# Altium schematic sheet LoRa.SchDoc
size A4
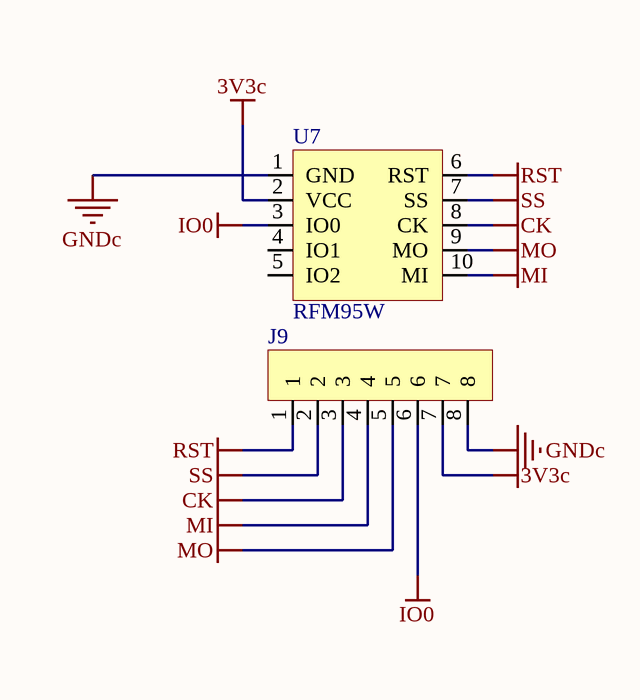
[diagram p0: LoRa.SchDoc]

## Parts
J9  8x1 CONN  [CONN8x1_2.54]  (value not drawn)
U7  RFM95W  [Bluee LoRa]

## Nets
3V3c: J9.7 U7.2(VCC)
CK: J9.3 U7.8(CK)
GNDc: J9.8 U7.1(GND)
IO0: J9.6 U7.3(IO0)
MI: J9.4 U7.10(MI)
MO: J9.5 U7.9(MO)
RST: J9.1 U7.6(RST)
SS: J9.2 U7.7(SS)

Not connected (* = marked no-connect by the designer): U7 4(IO1) 5(IO2)

## Library data of the parts
J9 = CONN 8x1: THT 8x1 2.54mm CONN
U7 = RMF95W: 915 MHz LoRa Transceiver